# EAGLE design Serial (EAGLE 5.06)
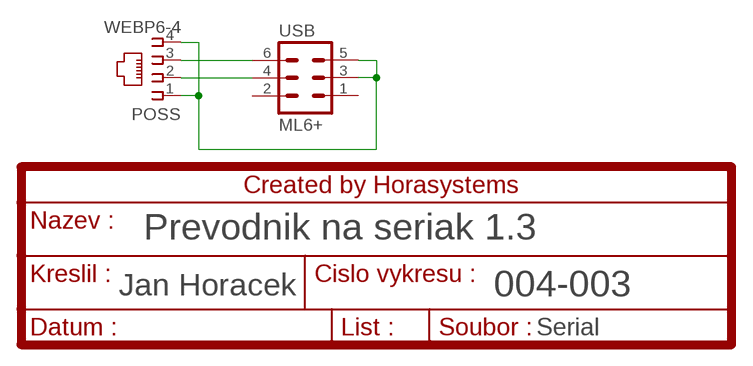
[diagram p0: schematic, sheet 1]

## Parts
POSS  WEBP6-4  [WEBP6-4]
USB  ML6+  [ML6+]

## Nets
A1: POSS.3 USB.6
A2: POSS.2 USB.4
GND: POSS.1 POSS.4 USB.3 USB.5
Unconnected: USB.1 USB.2

## Notes on the sheet
- Prevodnik na seriak 1.3
- 004-003

## Library data of the parts
POSS = con-malina:WEBP6-4
USB = con-ml:ML6+

## Board
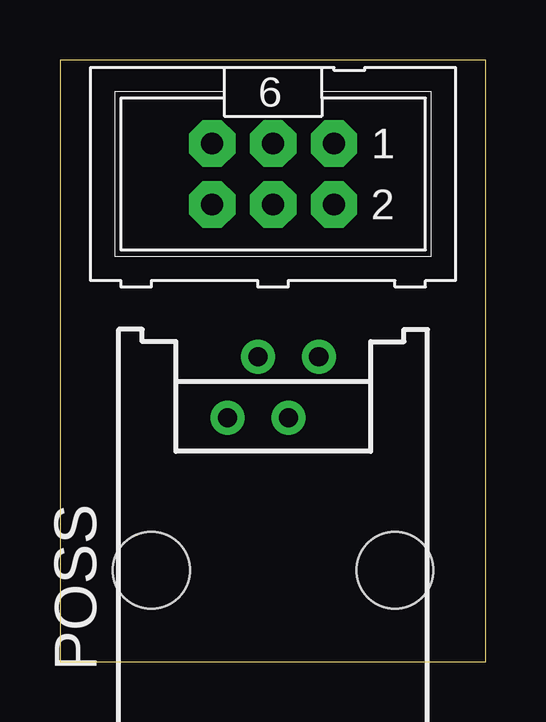
[diagram p1: board, top side]
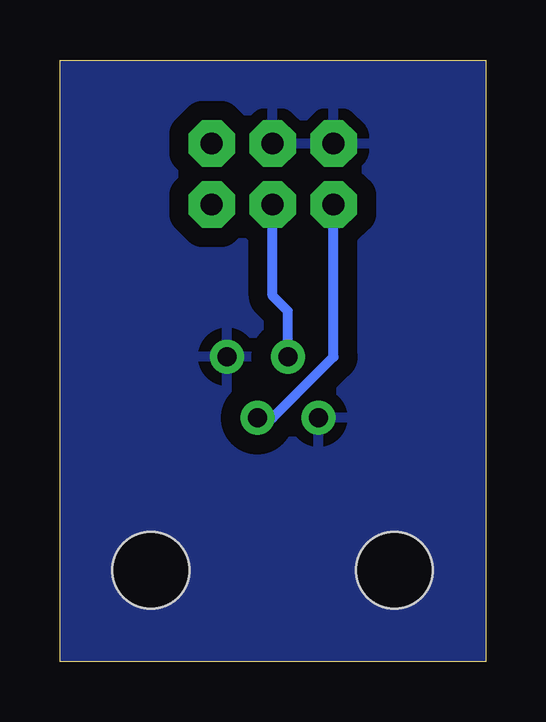
[diagram p2: board, bottom side, seen from below]

Size 17.76 x 25.07 mm. Coordinates in mm from the lower left corner, seen from the top.
Outline: 0,0 17.76,0 17.76,25.07 0,25.07 0,0
Copper layers (1*16): Top 0.035mm / dielectric 1.5mm / Bottom 0.035mm
Design rules "default *": minimum track width 10mil, minimum drill 24mil, track to track 0.8mm, track to pad 0.8mm, pad to pad 0.8mm, via to via 0.8mm, smd to smd 8mil, copper to edge 1mil, drill to drill 1mil, minimum pad ring 10mil, minimum via ring 8mil, stop-mask expansion 4mil, vias tented up to drill 0mil, thermal gap 0.5mm

### Footprints (pad centres in the part's own frame; a part is rotated, then mirrored left to right if it is on the bottom)
WEBP6-4 = drill 0.8 pad 1.422 round: 1 -1.905,6.35; 2 -0.635,8.89; 3 0.635,6.35; 4 1.905,8.89 | hole 3.2: -5.08,0; 5.08,0
ML6+ = drill 0.914 pad 1.93 octagon: 1 -2.54,-1.27; 2 -2.54,1.27; 3 0,-1.27; 4 0,1.27; 5 2.54,-1.27; 6 2.54,1.27

### Placement (x,y rotation side)
POSS  8.89,3.81 0 top
USB  8.89,20.32 180 top

### Tracks (layer width: path | path; a pad name or v marks a point on that pad's centre or on a via)
A1
  Bottom 0.406: POSS.3 8.89,10.16 6.35,12.7 USB.6
A2
  Bottom 0.406: POSS.2 8.26,14.61 8.89,15.24 USB.4
GND
  pour Bottom: 0,0 0,25.4 17.78,25.4 17.78,0